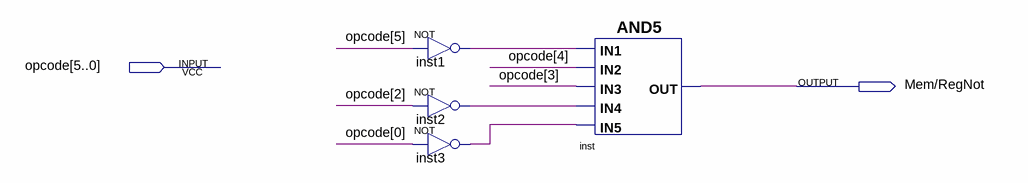
[diagram p0: schematic sheet]
// Quartus schematic MemRegDec.bdf as structural Verilog: 4 symbols, 2 pins
module MemRegDec (
  input  [5:0] opcode,
  output \Mem/RegNot 
);

  wire inst1_out, inst2_out, inst3_out;

  not inst1 (inst1_out, opcode[5]);
  not inst2 (inst2_out, opcode[2]);
  not inst3 (inst3_out, opcode[0]);
  and inst (\Mem/RegNot , inst1_out, opcode[4], opcode[3], inst2_out, inst3_out);
endmodule
